# Altium schematic sheet experimental.SchDoc
size A3
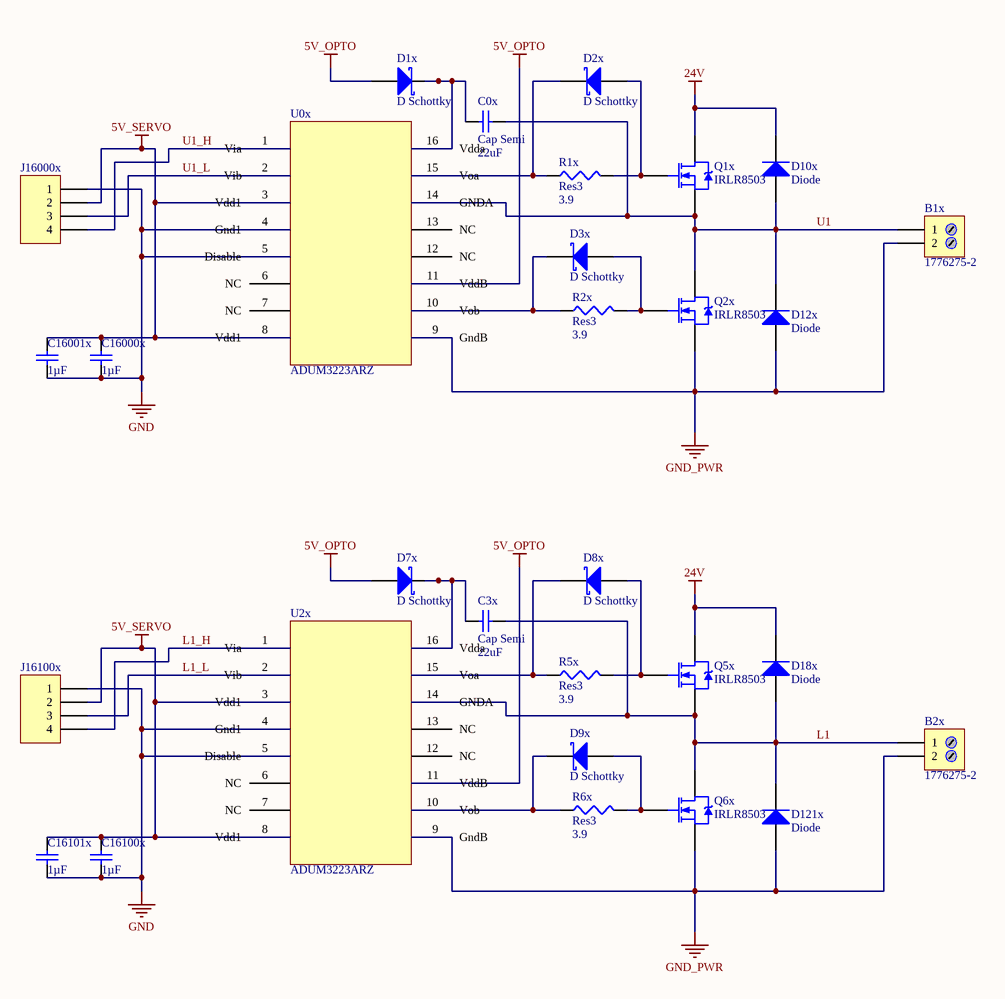
[diagram p0: experimental.SchDoc]

## Parts
B1x  1776275-2  [BORNIER_2V_3.5MM]
B2x  1776275-2  [BORNIER_2V_3.5MM]
C0x  Cap Semi  value 22uF  [C1210]
C3x  Cap Semi  value 22uF  [C1210]
C16000x  1µF  [WCAP-CSGP_0603, 1.6x0.8x0.8]
C16001x  1µF  [WCAP-CSGP_0603, 1.6x0.8x0.8]
C16100x  1µF  [WCAP-CSGP_0603, 1.6x0.8x0.8]
C16101x  1µF  [WCAP-CSGP_0603, 1.6x0.8x0.8]
D1x  D Schottky  [SMB]
D2x  D Schottky  [SMB]
D3x  D Schottky  [SMB]
D7x  D Schottky  [SMB]
D8x  D Schottky  [SMB]
D9x  D Schottky  [SMB]
D10x  Diode  [SMC]
D12x  Diode  [SMC]
D18x  Diode  [SMC]
D121x  Diode  [SMC]
J16000x  MC34645  [HDR1X4]  (value not drawn)
J16100x  MC34645  [HDR1X4]  (value not drawn)
Q1x  IRLR8503  [TO-252AA]
Q2x  IRLR8503  [TO-252AA]
Q5x  IRLR8503  [TO-252AA]
Q6x  IRLR8503  [TO-252AA]
R1x  Res3  value 3.9  [14-1210]
R2x  Res3  value 3.9  [14-1210]
R5x  Res3  value 3.9  [14-1210]
R6x  Res3  value 3.9  [14-1210]
U0x  ADUM3223ARZ  [SOIC16_N]
U2x  ADUM3223ARZ  [SOIC16_N]

## Nets
5V_OPTO: D1x.1(A) D7x.1(A) U0x.11(VddB) U2x.11(VddB)
5V_SERVO: C16000x.1 C16001x.1 C16100x.1 C16101x.1 J16000x.2 J16100x.2 U0x.3(Vdd1) U0x.8(Vdd1) U2x.3(Vdd1) U2x.8(Vdd1)
24V: D10x.2(K) D18x.2(K) Q1x.4(D) Q5x.4(D)
GND: C16000x.2 C16001x.2 C16100x.2 C16101x.2 J16000x.1 J16100x.1 U0x.4(Gnd1) U0x.5(Disable) U2x.4(Gnd1) U2x.5(Disable)
GND_PWR: B1x.2 B2x.2 D12x.1(A) D121x.1(A) Q2x.3(S) Q6x.3(S) U0x.9(GndB) U2x.9(GndB)
L1: B2x.1 C3x.2 D18x.1(A) D121x.2(K) Q5x.3(S) Q6x.4(D) U2x.14(GNDA)
L1_H: J16100x.4 U2x.1(Via)
L1_L: J16100x.3 U2x.2(Vib)
U1: B1x.1 C0x.2 D10x.1(A) D12x.2(K) Q1x.3(S) Q2x.4(D) U0x.14(GNDA)
U1_H: J16000x.4 U0x.1(Via)
U1_L: J16000x.3 U0x.2(Vib)
NetC0x_1: C0x.1 D1x.2(K) U0x.16(Vdda)
NetC3x_1: C3x.1 D7x.2(K) U2x.16(Vdda)
NetD2x_1: D2x.1(A) Q1x.1(G) R1x.2
NetD2x_2: D2x.2(K) R1x.1 U0x.15(Voa)
NetD3x_1: D3x.1(A) Q2x.1(G) R2x.2
NetD3x_2: D3x.2(K) R2x.1 U0x.10(Vob)
NetD8x_1: D8x.1(A) Q5x.1(G) R5x.2
NetD8x_2: D8x.2(K) R5x.1 U2x.15(Voa)
NetD9x_1: D9x.1(A) Q6x.1(G) R6x.2
NetD9x_2: D9x.2(K) R6x.1 U2x.10(Vob)

Not connected (* = marked no-connect by the designer): U0x 6(NC) 7(NC) 12(NC) 13(NC); U2x 6(NC) 7(NC) 12(NC) 13(NC)

## Library data of the parts
B1x B2x = 1776275-2: TERM BLOCK 2POS SIDE ENT 3.5MM; Manufacturer: TE Connectivity AMP Connectors; Supplier 1: Farnell; Supplier Part Number 1: 1098611; Manufacturer Part Number: 1776275-2; ComponentLink1URL: http://www.te.com/commerce/DocumentDelivery/DDEController?Action=srchrtrv&DocNm=1776275&DocType=Customer+Drawing&DocLang=English; ComponentLink1Description: http://www.te.com/commerce/DocumentDelivery/DDEController?Action=srchrtrv&DocNm=1776275&DocType=Customer+Drawing&DocLang=English
C0x C3x = Cap Semi: Capacitor (Semiconductor SIM Model); Published: 8-Jun-2000; LatestRevisionDate: 29-May-2009; LatestRevisionNote: IPC-7351 Footprint Added.; PackageReference: C1206; Publisher: Altium Limited; PackageDescription: Chip Capacitor
C16000x C16001x C16100x C16101x = WCAP-CSGP, 885012206095: CAP CER 100nF 50V X7R 0603; Manufacturer: Wurth Elektronik; PublishedDate: Aug 2016; ComponentLink1Description: Manufacturer; ComponentLink1URL: http://www.we-online.de; ComponentLink2Description: Datasheet; ComponentLink2URL: http://katalog.we-online.com/pbs/datasheet/885012206095.pdf; Manufacturer Part Number: 885012206095; Value: 100nF; Size: 0603; CeramicType: X7R; RatedVoltage: 50V; ComponentClass: 16_FPGA_STP
D1x D2x D3x D7x D8x D9x = D Schottky: Schottky Diode; Published: 8-Jun-2000; LatestRevisionDate: 17-Jul-2002; LatestRevisionNote: Re-released for DXP Platform.; PackageReference: SMB; Publisher: Altium Limited; PackageDescription: DO-214-AA/SMB; 2 C-Bend Leads; Body 5.3 x 3.6 mm, inc. leads (LxW); Code_JEDEC: DO-214-AA
D10x D12x D18x D121x = Diode: Default Diode; Published: 8-Jun-2000; LatestRevisionDate: 17-Jul-2002; LatestRevisionNote: Re-released for DXP Platform.; PackageVersion: Sep-1996; PackageReference: SMC; Publisher: Altium Limited; PackageDescription: DO-214-AB/SMC; 2 C-Bend Leads; Body 7.9 x 5.9 mm, inc. leads (LxW); Code_JEDEC: DO-214-AB
J16000x J16100x = MC34645: MULTICOMP - MC34645 - EMB. MALE COUDEE  CON. MALE 2.54MM 4VOIE; Supplier 1: Farnell; Manufacturer: MULTICOMP; Manufacturer Part Number: MC34645; ComponentLink1URL: http://www.farnell.com/datasheets/1751312.pdf; ComponentLink1Description: http://www.farnell.com/datasheets/1751312.pdf; Pricing: 1=0.597, 5=0.531, 25=0.465, 50=0.399, 100=0.334, 250=0.138 (EUR); Supplier Part Number 1: 1675775; ComponentClass: 16_FPGA_STP
Q1x Q2x Q5x Q6x = IRLR8503: HEXFET Power MOSFET; Note: Pin 2 is trimmed and not drawn; Published: 17-Sep-2003; DatasheetVersion: 21-Dec-2000; PackageVersion: Feb-2003; PackageReference: TO-252AA; Publisher: Altium Limited; PackageDescription: D-PAK/TO-252-AA; 3 Leads (1 Cropped); Body 10.4 (inc. leads) x 6.7 mm (LxW max); Code_JEDEC: TO-252-AA; ComponentLink1Description: Manufacturer Link; ComponentLink1URL: http://www.irf.com/; ComponentLink2Description: Datasheet; ComponentLink2URL: http://www.irf.com/product-info/datasheets/data/IRLR8503.pdf
R1x R2x R5x R6x = Res3: Resistor; Published: 8-Jun-2000; LatestRevisionDate: 29-May-2009; LatestRevisionNote: IPC-7351 Footprint Added.; PackageReference: J1-0603; Publisher: Altium Limited; PackageDescription: Chip Resistor